# Altium schematic sheet uC.SchDoc
size A
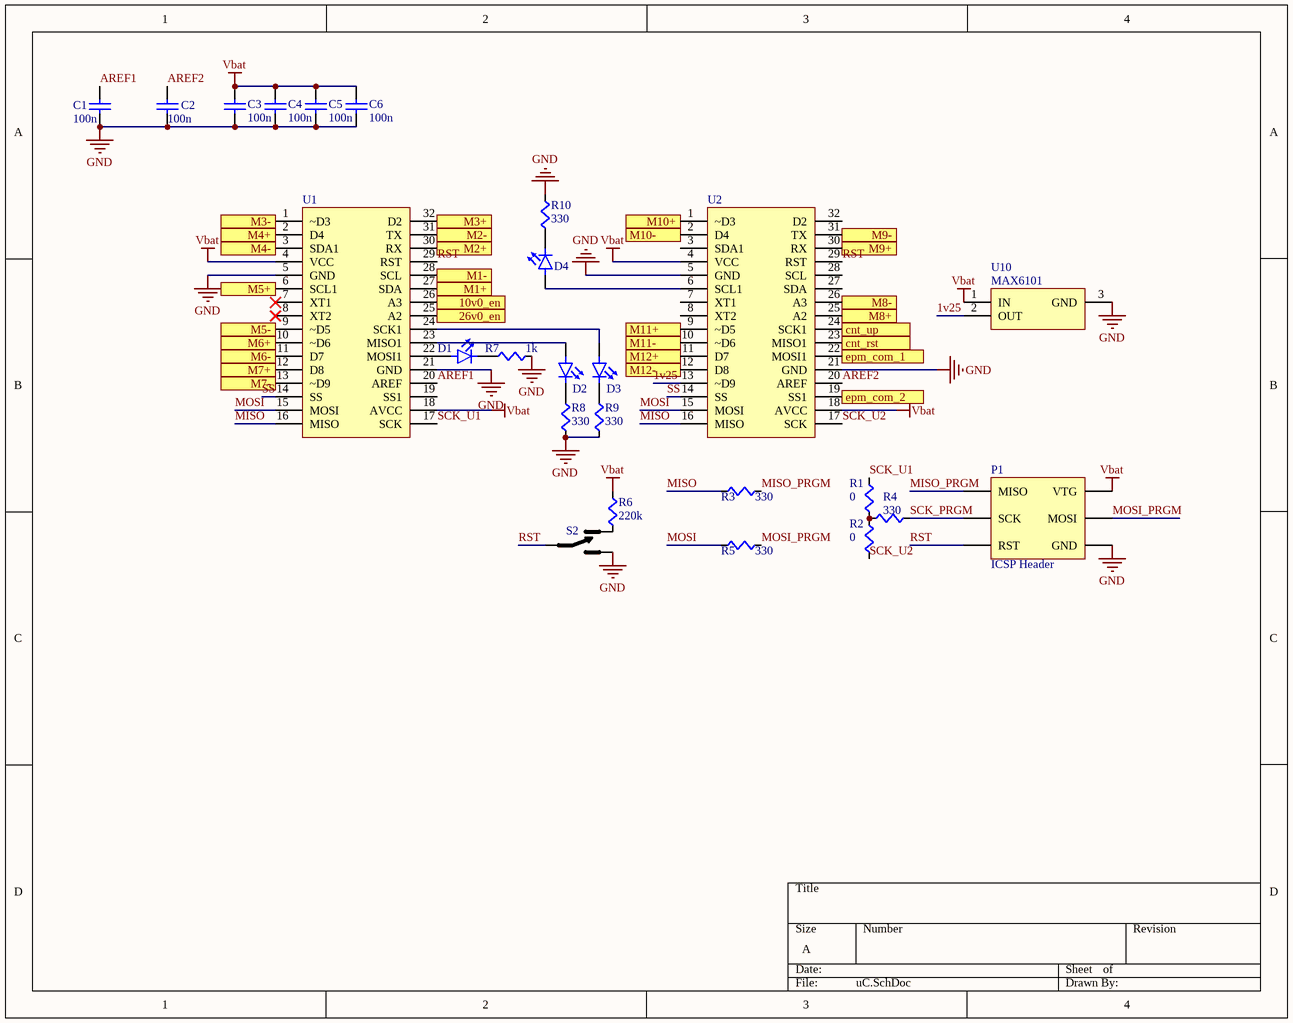
[diagram p0: uC.SchDoc]

## Parts
C1  value 100n  [SMD0603_cap]  (hidden comment: Cap)
C2  value 100n  [SMD0603_cap]  (hidden comment: Cap)
C3  value 100n  [SMD0603_cap]  (hidden comment: Cap)
C4  value 100n  [SMD0603_cap]  (hidden comment: Cap)
C5  value 100n  [SMD0603_cap]  (hidden comment: Cap)
C6  value 100n  [SMD0603_cap]  (hidden comment: Cap)
D1  LED  [SMD0603 POLARIZED]  (value not drawn)
D2  IR_LED  [smd_phototrans]  (value not drawn)
D3  IR_LED  [smd_phototrans]  (value not drawn)
D4  IR_LED  [smd_phototrans]  (value not drawn)
P1  ICSP Header  [icsp_pads]
R1  value 0  [SMD0603]  (hidden comment: Res)
R2  value 0  [SMD0603]  (hidden comment: Res)
R3  value 330  [SMD0603]  (hidden comment: Res)
R4  value 330  [SMD0603]  (hidden comment: Res)
R5  value 330  [SMD0603]  (hidden comment: Res)
R6  value 220k  [SMD0603]  (hidden comment: Res)
R7  value 1k  [SMD0603]  (hidden comment: Res)
R8  value 330  [SMD0603]  (hidden comment: Res)
R9  value 330  [SMD0603]  (hidden comment: Res)
R10  value 330  [SMD0603]  (hidden comment: Res)
S2  Switch_SPDT  [Switch_SPDT]  (value not drawn)
U1  ATMega328P_vqfn  [vqfn-32]  (value not drawn)
U2  ATMega328P_vqfn  [vqfn-32]  (value not drawn)
U10  MAX6101  [sot23]

## Ports
10v0_en (out), 26v0_en (out), cnt_rst (out), cnt_up (out), epm_com_1 (in), epm_com_2 (in), M1+ (out), M1- (out), M2+ (out), M2- (out), M3+ (out), M3- (out), M4+ (out), M4- (out), M5+ (out), M5- (out), M6+ (out), M6- (out), M7+ (out), M7- (out), M8+ (out), M8- (out), M9+ (out), M9- (out), M10+ (out), M10- (out), M11+ (out), M11- (out), M12+ (out), M12- (out)

## Nets
GND: C1.1 C2.1 C3.1 C4.1 C5.1 C6.1 P1.6(GND) R7.2 R8.1 R9.1 R10.1 S2.1 U1.5(GND) U1.21(GND) U2.5(GND) U2.21(GND) U10.3(GND)
Vbat: C3.2 C4.2 C5.2 C6.2 P1.2(VTG) R6.1 U1.4(VCC) U1.18(AVCC) U2.4(VCC) U2.18(AVCC) U10.1(IN)
1v25: U2.13(~D9) U10.2(OUT)
10v0_en: U1.26(A3) ; port 10v0_en
26v0_en: U1.25(A2) ; port 26v0_en
AREF1: C1.2 U1.20(AREF)
AREF2: C2.2 U2.20(AREF)
cnt_rst: U2.23(MISO1) ; port cnt_rst
cnt_up: U2.24(SCK1) ; port cnt_up
epm_com_1: U2.22(MOSI1) ; port epm_com_1
epm_com_2: U2.19(SS1) ; port epm_com_2
M1+: U1.27(SDA) ; port M1+
M1-: U1.28(SCL) ; port M1-
M2+: U1.30(RX) ; port M2+
M2-: U1.31(TX) ; port M2-
M3+: U1.32(D2) ; port M3+
M3-: U1.1(~D3) ; port M3-
M4+: U1.2(D4) ; port M4+
M4-: U1.3(SDA1) ; port M4-
M5+: U1.6(SCL1) ; port M5+
M5-: U1.9(~D5) ; port M5-
M6+: U1.10(~D6) ; port M6+
M6-: U1.11(D7) ; port M6-
M7+: U1.12(D8) ; port M7+
M7-: U1.13(~D9) ; port M7-
M8+: U2.25(A2) ; port M8+
M8-: U2.26(A3) ; port M8-
M9+: U2.30(RX) ; port M9+
M9-: U2.31(TX) ; port M9-
M10+: U2.1(~D3) ; port M10+
M10-: U2.2(D4) ; port M10-
M11+: U2.9(~D5) ; port M11+
M11-: U2.10(~D6) ; port M11-
M12+: U2.11(D7) ; port M12+
M12-: U2.12(D8) ; port M12-
MISO: R3.2 U1.16(MISO) U2.16(MISO)
MISO_PRGM: P1.1(MISO) R3.1
MOSI: R5.2 U1.15(MOSI) U2.15(MOSI)
MOSI_PRGM: P1.4(MOSI) R5.1
RST: P1.5(RST) S2.2 U1.29(RST) U2.29(RST)
SCK_PRGM: P1.3(SCK) R4.1
SCK_U1: R1.2 U1.17(SCK)
SCK_U2: R2.1 U2.17(SCK)
SS: U1.14(SS) U2.14(SS)
NetD1_1: D1.1(Anode_(+)) U1.22(MOSI1)
NetD1_2: D1.2(Cathode_(-)) R7.1
NetD2_1: D2.1(Anode_(+)) U1.23(MISO1)
NetD2_2: D2.2(Cathode_(-)) R8.2
NetD3_1: D3.1(Anode_(+)) U1.24(SCK1)
NetD3_2: D3.2(Cathode_(-)) R9.2
NetD4_1: D4.1(Anode_(+)) U2.6(SCL1)
NetD4_2: D4.2(Cathode_(-)) R10.2
NetR1_1: R1.1 R2.2 R4.2
NetR6_2: R6.2 S2.3

Not connected (* = marked no-connect by the designer): U1 7(XT1)* 8(XT2)* 19(SS1); U2 3(SDA1) 7(XT1) 8(XT2) 27(SDA) 28(SCL) 32(D2)

## Library data of the parts
C1-C6 = Capacitor Ceramic: Ceramic Chip Capacitor
R1-R10 = Resistor